# Altium schematic sheet COM.SchDoc (part 3 of 3)
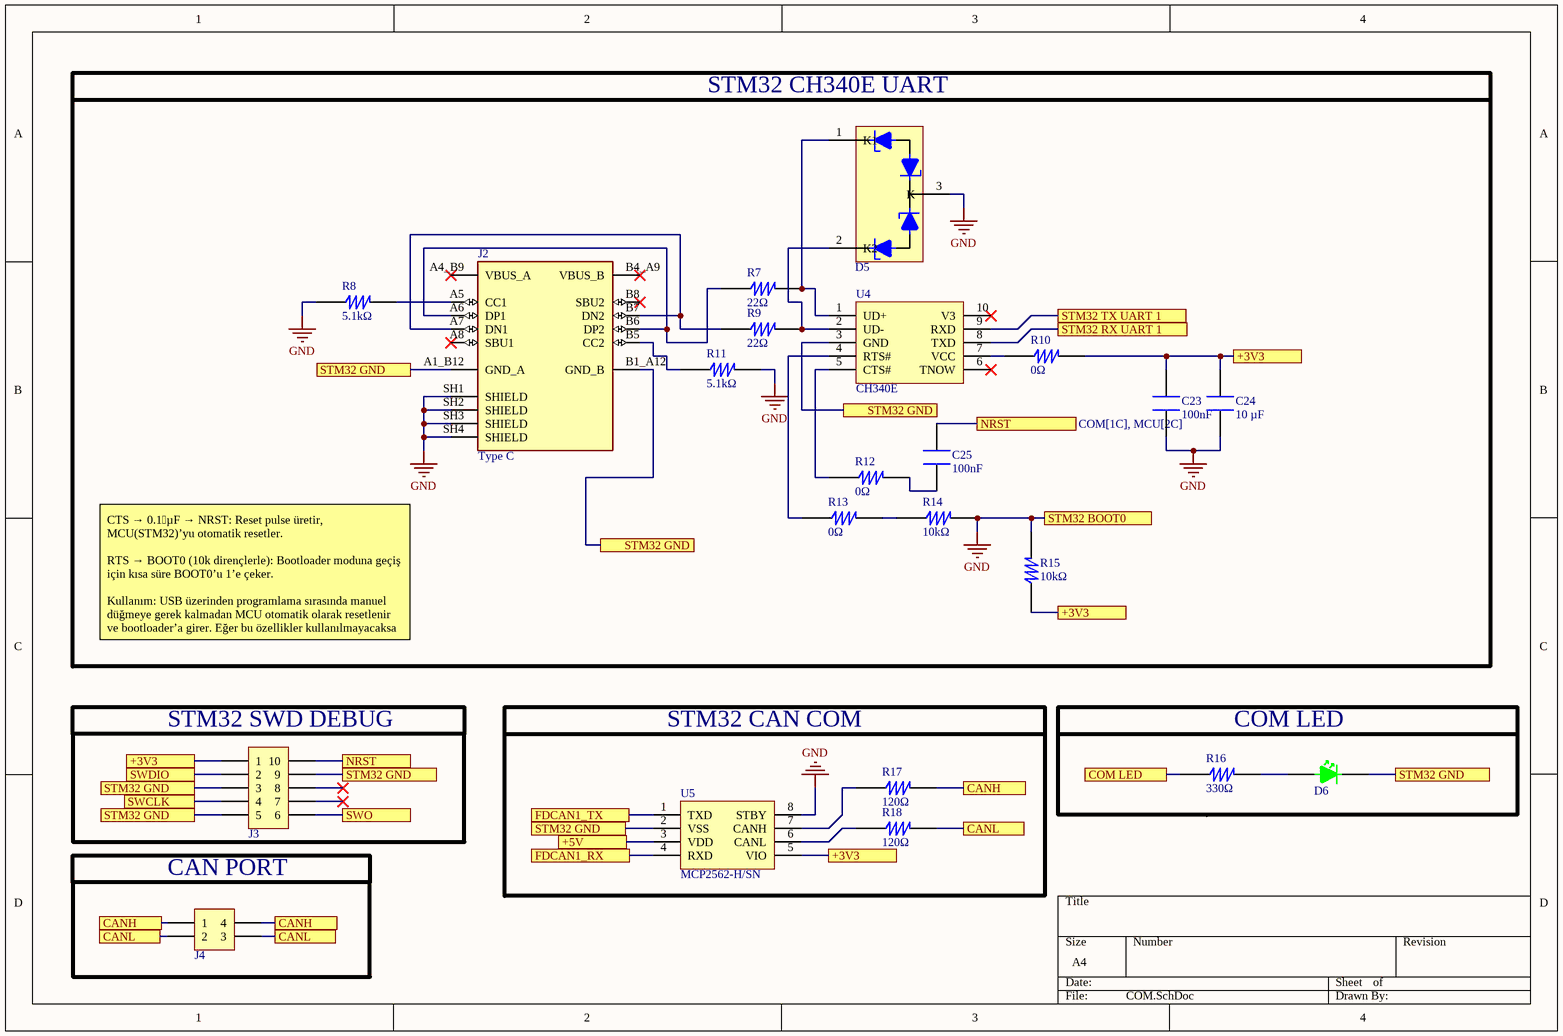
[diagram p2: COM.SchDoc]

## Library data of the parts (continued)
U5 = MCP2562-H/SN: 1/1 Transceiver Half CANbus 8-SOIC; Manufacturer: Microchip; Data Rate: 1Mbps; Interface: CAN; Max Junction Temperature (Tj): 190°C; Max Supply Voltage: 5.5V; Min Supply Voltage: 1.8V; Nominal Supply Current: 70mA; Number of Transceivers: 1; Propagation Delay: 125ns; Supplier: Arrow Electronics; Manufacturer Part Number: MCP2562-H/SN; RoHS: Compliant; Category: CAN Transceivers; Stock: 200; Pricing: 200=0,9808 (USD); Projected EOL Date: 2039-03-19; Ambient Temperature Range High: 150°C; Case/Package: SOIC; Country of Assembly: Thailand; Country of Fabrication: Taiwan; Country of Origin: Thailand; Export Control Classification Number (ECCN) Code: EAR99; Height: 1.75mm; Harmonized Tariff Schedule (HTS) Code: 8542.39.0060; Introduction Date: 2013-03-19; Lead Free: Lead Free; Lifecycle Status: Production; Max Operating Temperature: 150°C; Min Operating Temperature: -40°C; Mounting Technology: Surface Mount; Pins: 8; Radiation Hardening: No; Schedule B: 8529906000; Turn-On Delay Time: 125ns; ComponentLink1URL: https://datasheet.octopart.com:443/MCP2562-H-SN-Microchip-datasheet-38190264.pdf?src-supplier=Microchip; ComponentLink1Description: https://datasheet.octopart.com:443/MCP2562-H-SN-Microchip-datasheet-38190264.pdf?src-supplier=Microchip; ComponentLink2URL: https://datasheet.octopart.com/MCP2562-H-SN-Microchip-datasheet-15670463.pdf; ComponentLink2Description: https://datasheet.octopart.com/MCP2562-H-SN-Microchip-datasheet-15670463.pdf; ComponentLink3URL: http://sigma.octopart.com:80/188449173/materials_sheet/Microchip-MCP2562-H-SN.pdf?src-supplier=Compliance+Statements; ComponentLink3Description: http://sigma.octopart.com:80/188449173/materials_sheet/Microchip-MCP2562-H-SN.pdf?src-supplier=Compliance+Statements; ComponentLink4URL: http://sigma.octopart.com:80/conflict_mineral_statement/Microchip-company-69.pdf?src-supplier=Compliance+Statements; ComponentLink4Description: http://sigma.octopart.com:80/conflict_mineral_statement/Microchip-company-69.pdf?src-supplier=Compliance+Statements; ComponentLink5URL: http://sigma.octopart.com:80/conflict_mineral_statement/Microchip-company-68.pdf?src-supplier=Compliance+Statements; ComponentLink5Description: http://sigma.octopart.com:80/conflict_mineral_statement/Microchip-company-68.pdf?src-supplier=Compliance+Statements; ComponentLink6URL: http://sigma.octopart.com:80/reach_statement/Microchip-company-70.pdf?src-supplier=Compliance+Statements; ComponentLink6Description: http://sigma.octopart.com:80/reach_statement/Microchip-company-70.pdf?src-supplier=Compliance+Statements; ComponentLink7URL: http://sigma.octopart.com:80/rohs_statement/Microchip-company-71.pdf?src-supplier=Compliance+Statements; ComponentLink7Description: http://sigma.octopart.com:80/rohs_statement/Microchip-company-71.pdf?src-supplier=Compliance+Statements; Supplier Part Number: MCP2562-H/SN